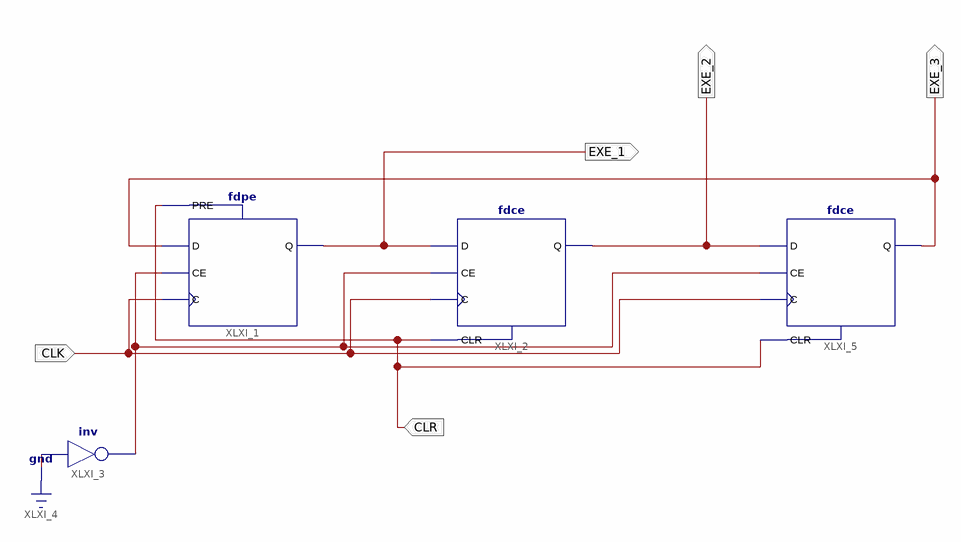
[diagram p0: schematic sheet 1]
// Xilinx ISE schematic SEQUENCE_2.sch (spartan3e) as structural Verilog: 4 symbols, 5 ports
module SEQUENCE_2 (
  input  CLK,
  input  CLR,
  output EXE_1,
  output EXE_2,
  output EXE_3
);

  wire XLXN_3;

  fdpe XLXI_1 (.C(CLK), .CE(XLXN_3), .D(EXE_3), .PRE(CLR), .Q(EXE_1));
  fdce XLXI_2 (.C(CLK), .CE(XLXN_3), .CLR(CLR), .D(EXE_1), .Q(EXE_2));
  not XLXI_3 (XLXN_3, 1'b0);
  fdce XLXI_5 (.C(CLK), .CE(XLXN_3), .CLR(CLR), .D(EXE_2), .Q(EXE_3));
endmodule
